# Altium schematic sheet FPGA_165B_DigitalIO.SchDoc
size A; Organization: Altium Limited; Address1: L3, 12a Rodborough Rd; Address2: Frenchs Forest; Address3: NSW; Address4: Australia 2086; DocumentNumber: 1; SheetNumber: 1; SheetTotal: 1
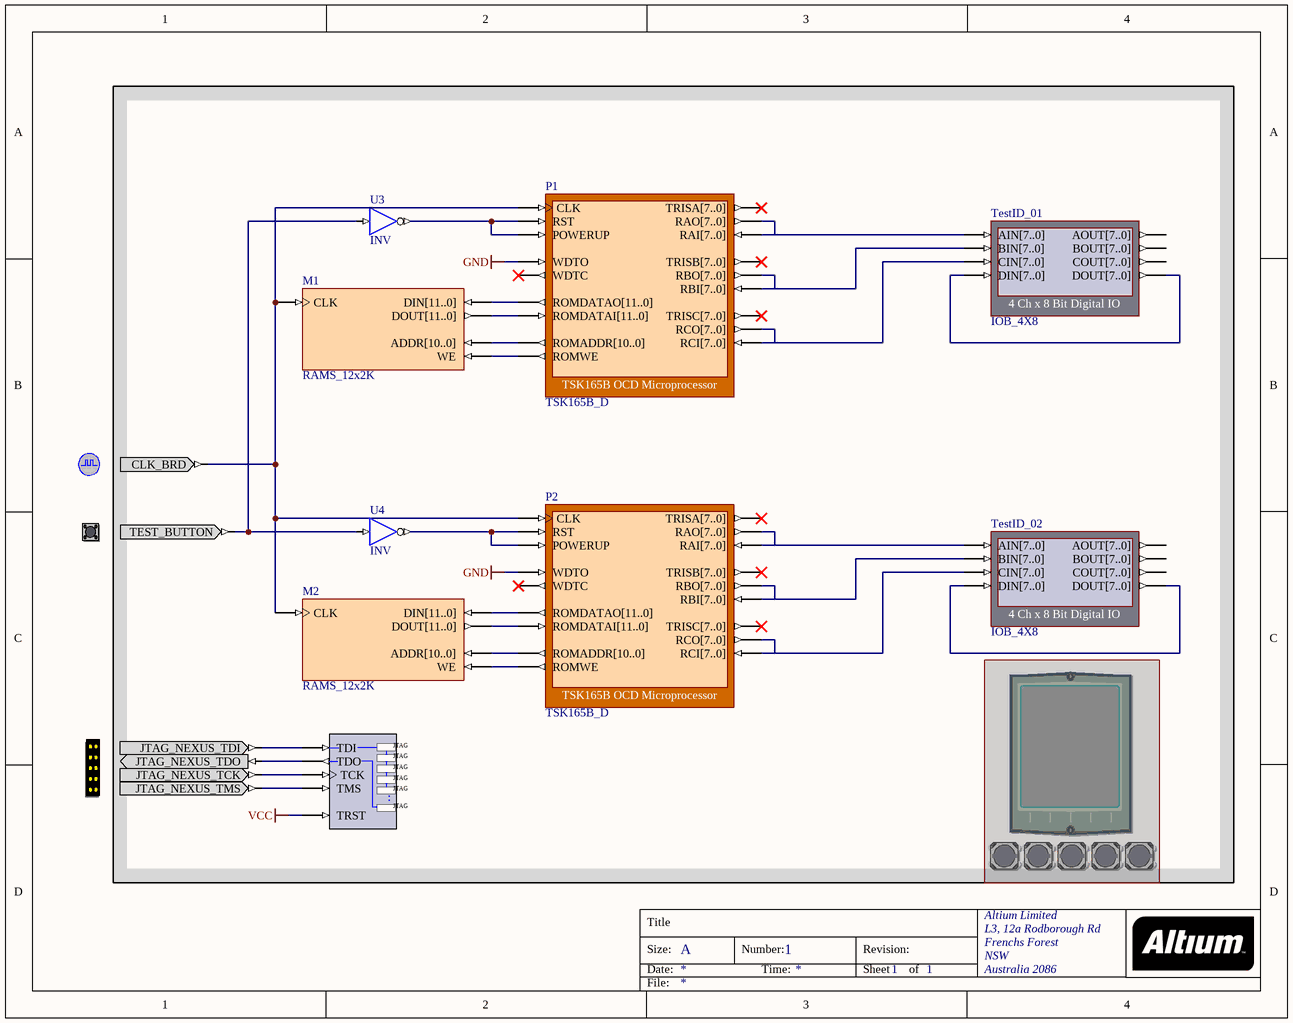
[diagram p0: FPGA_165B_DigitalIO.SchDoc]

## Parts
(Parts that share a designator on the sheet are numbered #1, #2 ... from top to bottom, then left to right.)
?#1  CLOCK_BOARD  (value not drawn)
?#2  TEST_BUTTON  (value not drawn)
?#3  FIRMWARE_TFT_ENABLE  (value not drawn)  (masked out: inside a compile mask, not in the netlist)
?#4  NEXUS_JTAG_CONNECTOR  (value not drawn)
?#5  FIRMWARE_BUTTONS_ENABLE  (value not drawn)  (masked out: inside a compile mask, not in the netlist)
M1  RAMS_12x2K
M2  RAMS_12x2K
NEXUS_JTAG_PORT  NEXUS_JTAG_PORT  (value not drawn)
P1  TSK165B_D
P2  TSK165B_D
TestID_01  IOB_4X8
TestID_02  IOB_4X8
U3  INV
U4  INV

## Nets
GND: P1.WDTO P2.WDTO
VCC: NEXUS_JTAG_PORT.TRST
Net?#1_CLK_BRD: ?#1.CLK_BRD M1.CLK M2.CLK P1.CLK P2.CLK
Net?#2_TEST_BUTTON: ?#2.TEST_BUTTON U3.I U4.I
Net?#4_JTAG_NEXUS_TCK: ?#4.JTAG_NEXUS_TCK NEXUS_JTAG_PORT.TCK
Net?#4_JTAG_NEXUS_TDI: ?#4.JTAG_NEXUS_TDI NEXUS_JTAG_PORT.TDI
Net?#4_JTAG_NEXUS_TDO: ?#4.JTAG_NEXUS_TDO NEXUS_JTAG_PORT.TDO
Net?#4_JTAG_NEXUS_TMS: ?#4.JTAG_NEXUS_TMS NEXUS_JTAG_PORT.TMS
NetM1_ADDR[10..0]: M1.ADDR[10..0] P1.ROMADDR[10..0]
NetM1_DIN[11..0]: M1.DIN[11..0] P1.ROMDATAO[11..0]
NetM1_DOUT[11..0]: M1.DOUT[11..0] P1.ROMDATAI[11..0]
NetM1_WE: M1.WE P1.ROMWE
NetM2_ADDR[10..0]: M2.ADDR[10..0] P2.ROMADDR[10..0]
NetM2_DIN[11..0]: M2.DIN[11..0] P2.ROMDATAO[11..0]
NetM2_DOUT[11..0]: M2.DOUT[11..0] P2.ROMDATAI[11..0]
NetM2_WE: M2.WE P2.ROMWE
NetP1_POWERUP: P1.POWERUP P1.RST U3.O
NetP1_RAI[7..0]: P1.RAI[7..0] P1.RAO[7..0] TestID_01.AIN[7..0]
NetP1_RBI[7..0]: P1.RBI[7..0] P1.RBO[7..0] TestID_01.BIN[7..0]
NetP1_RCI[7..0]: P1.RCI[7..0] P1.RCO[7..0] TestID_01.CIN[7..0]
NetP2_POWERUP: P2.POWERUP P2.RST U4.O
NetP2_RAI[7..0]: P2.RAI[7..0] P2.RAO[7..0] TestID_02.AIN[7..0]
NetP2_RBI[7..0]: P2.RBI[7..0] P2.RBO[7..0] TestID_02.BIN[7..0]
NetP2_RCI[7..0]: P2.RCI[7..0] P2.RCO[7..0] TestID_02.CIN[7..0]
NetTestID_01_DIN[7..0]: TestID_01.DIN[7..0] TestID_01.DOUT[7..0]
NetTestID_02_DIN[7..0]: TestID_02.DIN[7..0] TestID_02.DOUT[7..0]

Not connected (* = marked no-connect by the designer): P1 TRISA[7..0]* TRISB[7..0]* TRISC[7..0]* WDTC*; P2 TRISA[7..0]* TRISB[7..0]* TRISC[7..0]* WDTC*; TestID_01 AOUT[7..0] BOUT[7..0] COUT[7..0]; TestID_02 AOUT[7..0] BOUT[7..0] COUT[7..0]

## Notes on the sheet
- Title
- Size:
- Date:
- A
- Number:
- Time:
- Revision:
- Sheet
- of
- File:
- (in symbol NEXUS_JTAG_PORT) JTAG; .

## Library data of the parts
?#1 = CLOCK_BOARD: Global System Clock Supply; PortComponent: True; Published: 19-Nov-2003; Publisher: Altium Limited; HelpURL: TR0143 Technical Reference Manual for Altium's Desktop NanoBoard NB2DSK01.pdf#page=41; UseInDSF: True
?#2 = TEST_BUTTON: Test / Reset Button; PortComponent: True; Published: 19-Nov-2003; Publisher: Altium Limited; HelpURL: TR0143 Technical Reference Manual for Altium's Desktop NanoBoard NB2DSK01.pdf#page=53
?#3 = FIRMWARE_TFT_ENABLE: TFT LCD Panel; PortComponent: True; Published: 22-Jan-2007; Publisher: Altium Limited; HelpURL: TR0143 Technical Reference Manual for Altium's Desktop NanoBoard NB2DSK01.pdf#page=50
?#4 = NEXUS_JTAG_CONNECTOR: JTAG Port; PortComponent: True; Published: 19-Nov-2003; Publisher: Altium Limited
?#5 = FIRMWARE_BUTTONS_ENABLE: Generic User Buttons; PortComponent: True; Published: 16-Apr-2007; Publisher: Altium Limited; HelpURL: TR0143 Technical Reference Manual for Altium's Desktop NanoBoard NB2DSK01.pdf#page=53
M1 M2 = RAMS_12x2K: Single Port Random Access Memory; Memory_Depth: 2048; Memory_Type: RAM_SinglePortBlock; Memory_Width: 12; Memory_ClockEdge: Rising; Nexus_Core: Memory_Program; Published: 13/01/2004; Publisher: Altium Hobart Technology Center
NEXUS_JTAG_PORT = NEXUS_JTAG_PORT: Soft Nexus-Chain Connector; NEXUS_JTAG_CONNECTOR: True; Published: 18-Dec-2003; Publisher: Altium Limited
P1 = TSK165B_D: TSK165B OCD Microprocessor; NEXUS_CORE: Processor_OCDS; NEXUS_JTAG_DEVICE: True; NEXUS_JTAG_ORDER: 0; ChildModel1: TSK165B_D_RAM128x8; ChildCore1: M1; ChildModel2: TSK165B_D_RAM128x8_prim0; Published: 17-Nov-2004; Publisher: Altium Limited; ComponentLink1Description: Core &Resource Usage; ComponentLink1URL: CR0140 FPGA Processor Resource Usage.pdf#page=19; HelpURL: CR0114 TSK165x RISC MCU.pdf; LastRevisionNo: 1.00.00; ComponentLink2Description: Embedded &Tools Guide; ComponentLink2URL: GU0108 Using the TSK165x Embedded Tools.pdf; ComponentLink3Description: Embedded T&echnical References; ComponentLink3URL: TR0106 TSK165x Embedded Tools Reference.pdf
P2 = TSK165B_D: TSK165B OCD Microprocessor; NEXUS_CORE: Processor_OCDS; NEXUS_JTAG_DEVICE: True; NEXUS_JTAG_ORDER: 0; ChildModel1: TSK165B_D_RAM128x8; ChildCore1: M2; ChildModel2: TSK165B_D_RAM128x8_prim0; Published: 17-Nov-2004; Publisher: Altium Limited; ComponentLink1Description: Core &Resource Usage; ComponentLink1URL: CR0140 FPGA Processor Resource Usage.pdf#page=19; HelpURL: CR0114 TSK165x RISC MCU.pdf; LastRevisionNo: 1.00.00; ComponentLink2Description: Embedded &Tools Guide; ComponentLink2URL: GU0108 Using the TSK165x Embedded Tools.pdf; ComponentLink3Description: Embedded T&echnical References; ComponentLink3URL: TR0106 TSK165x Embedded Tools Reference.pdf
TestID_01 TestID_02 = IOB_4X8: 4 Ch x 8 Bit Digital IO; NEXUS_CORE: Instrument; NEXUS_JTAG_DEVICE: True; NEXUS_JTAG_ORDER: 0; Published: 30/09/2003; Publisher: Altium Hobart Technology Centre; Core Revision: 1.00.00
U3 U4 = INV: Inverter; ArchiveName: GENERIC; Published: 18-Nov-2003; Publisher: Altium Limited; Xilinx Equivalent: INV; Core Revision: 1.00.00